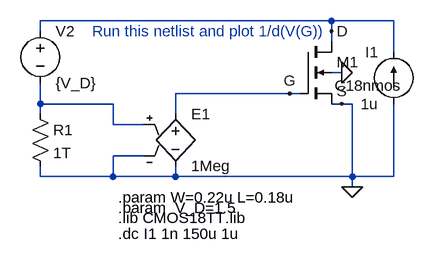
[diagram p0: schematic NMOS-gm-testbench.asc]
NMOS-gm-testbench.asc, the LTspice schematic file:
Version 4
SHEET 1 880 680
WIRE 80 48 -368 48
WIRE 176 48 80 48
WIRE -368 64 -368 48
WIRE 80 64 80 48
WIRE 80 80 80 64
WIRE 176 96 176 48
WIRE 96 128 80 128
WIRE 16 160 -160 160
WIRE 32 160 16 160
WIRE -368 176 -368 144
WIRE -256 176 -368 176
WIRE 96 176 80 176
WIRE 112 176 96 176
WIRE -368 192 -368 176
WIRE -160 192 -160 160
WIRE -256 208 -256 176
WIRE -208 208 -256 208
WIRE -208 256 -256 256
WIRE -368 288 -368 272
WIRE -256 288 -256 256
WIRE -256 288 -368 288
WIRE -160 288 -160 272
WIRE -160 288 -256 288
WIRE 112 288 112 176
WIRE 112 288 -160 288
WIRE 176 288 176 176
WIRE 176 288 112 288
WIRE 112 304 112 288
FLAG 112 304 0
FLAG 96 128 0
FLAG 16 160 G
FLAG 96 176 S
FLAG 80 64 D
SYMBOL nmos4 32 80 R0
WINDOW 3 53 68 Left 2
SYMATTR Value C18nmos
SYMATTR InstName M1
SYMATTR Value2 l={L} w={W}
SYMBOL voltage -368 48 R0
SYMATTR InstName V2
SYMATTR Value {V_D}
SYMBOL current 176 176 R180
WINDOW 0 24 80 Left 2
WINDOW 3 24 0 Left 2
SYMATTR InstName I1
SYMATTR Value 1u
SYMBOL e -160 176 R0
SYMATTR InstName E1
SYMATTR Value 1Meg
SYMBOL res -384 176 R0
SYMATTR InstName R1
SYMATTR Value 1T
TEXT -248 320 Left 2 !.param W=0.22u L=0.18u
TEXT -248 336 Left 2 !.param  V_D=1.5
TEXT -248 352 Left 2 !.lib CMOS18TT.lib
TEXT -288 64 Left 2 ;Run this netlist and plot 1/d(V(G))
TEXT -248 376 Left 2 !.dc I1 1n 150u 1u

The netlist it stands for:
* NMOS-gm-testbench.asc
M1 D G 0 0 C18nmos l={L} w={W}
V2 D N001 {V_D}
I1 0 D 1u
E1 G 0 N001 0 1Meg
R1 N001 0 1T
.model NMOS NMOS
.model PMOS PMOS
.lib standard.mos
.param W=0.22u L=0.18u
.param  V_D=1.5
.lib CMOS18TT.lib
* Run this netlist and plot 1/d(V(G))
.dc I1 1n 150u 1u
.backanno
.end